# EAGLE schematic arduino-uno-shield (EAGLE 9.0.0)
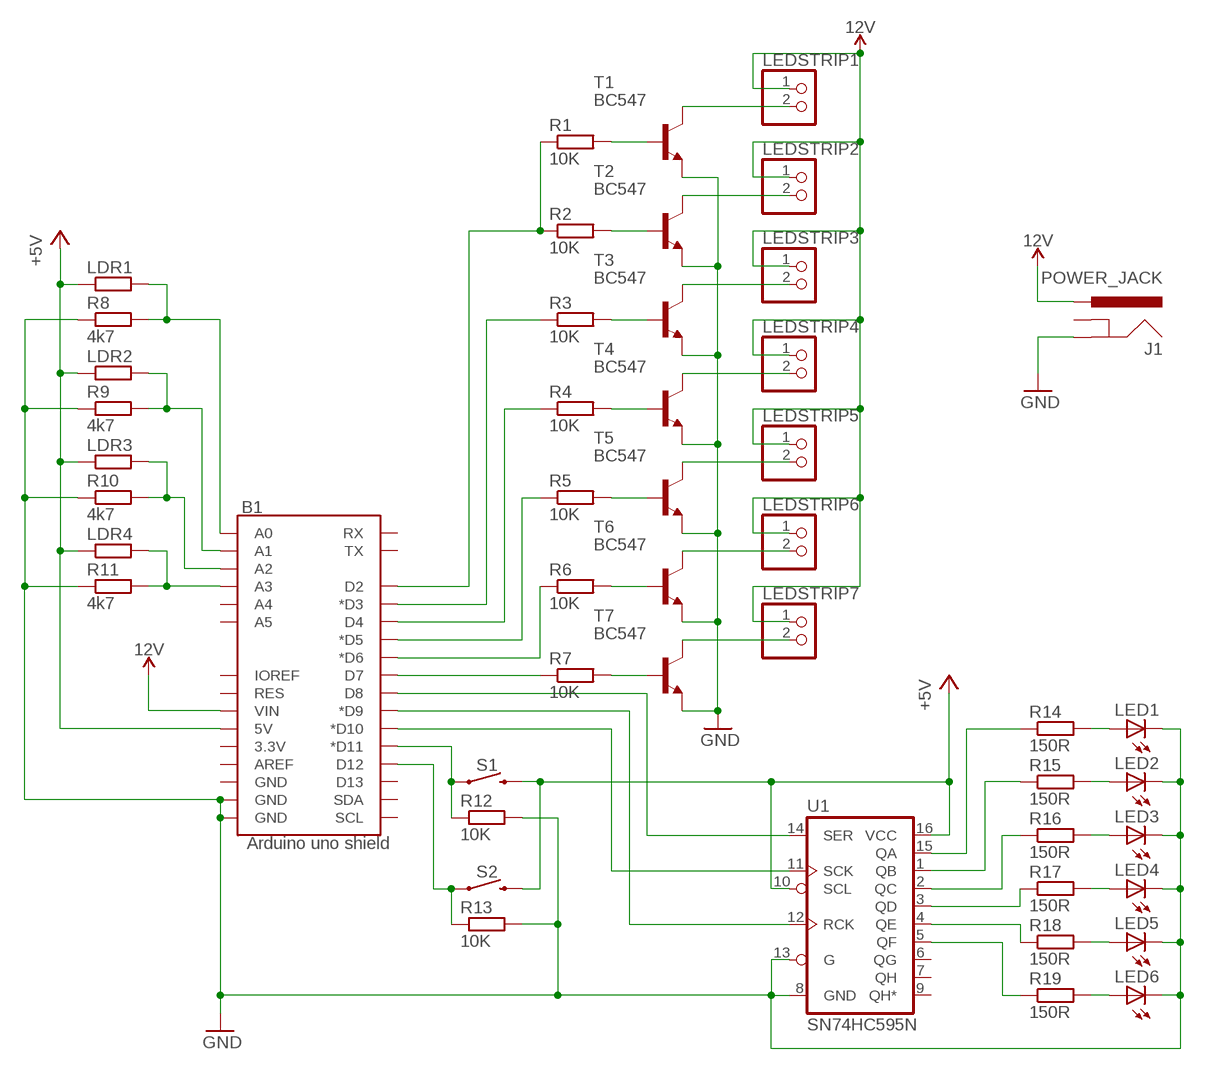
[diagram p0: schematic, sheet 1]

## Parts
B1  Arduino uno shield  ARDUINO_UNO_R3_SHIELDUNO_R3_SHIELD_NOLABELS_LOCK  [UNO_R3_SHIELD_NOLABELS_LOCK]
J1  POWER_JACK  [POWER_JACK_PTH]
LDR1  R-EU_0204/5  [0204/5]
LDR2  R-EU_0204/5  [0204/5]
LDR3  R-EU_0204/5  [0204/5]
LDR4  R-EU_0204/5  [0204/5]
LED1  LED5MM  [LED5MM]
LED2  LED5MM  [LED5MM]
LED3  LED5MM  [LED5MM]
LED4  LED5MM  [LED5MM]
LED5  LED5MM  [LED5MM]
LED6  LED5MM  [LED5MM]
LEDSTRIP1  PINHD-1X2  [1X02]
LEDSTRIP2  PINHD-1X2  [1X02]
LEDSTRIP3  PINHD-1X2  [1X02]
LEDSTRIP4  PINHD-1X2  [1X02]
LEDSTRIP5  PINHD-1X2  [1X02]
LEDSTRIP6  PINHD-1X2  [1X02]
LEDSTRIP7  PINHD-1X2  [1X02]
R1  10K  R-EU_0204/5  [0204/5]
R2  10K  R-EU_0204/5  [0204/5]
R3  10K  R-EU_0204/5  [0204/5]
R4  10K  R-EU_0204/5  [0204/5]
R5  10K  R-EU_0204/5  [0204/5]
R6  10K  R-EU_0204/5  [0204/5]
R7  10K  R-EU_0204/5  [0204/5]
R8  4k7  R-EU_0204/5  [0204/5]
R9  4k7  R-EU_0204/5  [0204/5]
R10  4k7  R-EU_0204/5  [0204/5]
R11  4k7  R-EU_0204/5  [0204/5]
R12  10K  R-EU_0204/5  [0204/5]
R13  10K  R-EU_0204/5  [0204/5]
R14  150R  R-EU_0204/5  [0204/5]
R15  150R  R-EU_0204/5  [0204/5]
R16  150R  R-EU_0204/5  [0204/5]
R17  150R  R-EU_0204/5  [0204/5]
R18  150R  R-EU_0204/5  [0204/5]
R19  150R  R-EU_0204/5  [0204/5]
S1  MOMENTARY-SWITCH-SPST-PTH-6.0MM  [TACTILE_SWITCH_PTH_6.0MM]
S2  MOMENTARY-SWITCH-SPST-PTH-6.0MM  [TACTILE_SWITCH_PTH_6.0MM]
T1  BC547  [TO92]
T2  BC547  [TO92]
T3  BC547  [TO92]
T4  BC547  [TO92]
T5  BC547  [TO92]
T6  BC547  [TO92]
T7  BC547  [TO92]
U1  SN74HC595N  74HC595N  [DIP16]

## Nets
12V: B1.VIN J1.PWR LEDSTRIP1.1 LEDSTRIP2.1 LEDSTRIP3.1 LEDSTRIP4.1 LEDSTRIP5.1 LEDSTRIP6.1 LEDSTRIP7.1
+5V: B1.5V LDR1.1 LDR2.1 LDR3.1 LDR4.1 S1.3 S2.3 U1.10(SCL) U1.16(VCC)
GND: B1.GND@0(GND) B1.GND@1(GND) J1.GND LED1.K(C) LED2.K(C) LED3.K(C) LED4.K(C) LED5.K(C) LED6.K(C) R8.1 R9.1 R10.1 R11.1 R12.2 R13.2 T1.1(E) T2.1(E) T3.1(E) T4.1(E) T5.1(E) T6.1(E) T7.1(E) U1.8(GND) U1.13(G)
N$1: R1.2 T1.2(B)
N$2: R2.2 T2.2(B)
N$3: LEDSTRIP1.2 T1.3(C)
N$4: R3.2 T3.2(B)
N$5: R4.2 T4.2(B)
N$6: R5.2 T5.2(B)
N$7: R6.2 T6.2(B)
N$8: R7.2 T7.2(B)
N$9: B1.D2 R1.1 R2.1
N$10: B1.D7 R7.1
N$11: B1.A0 LDR1.2 R8.2
N$12: B1.D3(*D3) R3.1
N$13: B1.D4 R4.1
N$14: B1.D5(*D5) R5.1
N$15: B1.D6(*D6) R6.1
N$16: B1.A1 LDR2.2 R9.2
N$17: B1.A2 LDR3.2 R10.2
N$18: B1.A3 LDR4.2 R11.2
N$19: B1.D11(*D11) R12.1 S1.1
N$20: B1.D12 R13.1 S2.1
N$21: R14.1 U1.15(QA)
N$22: B1.D8 U1.14(SER)
N$23: B1.D9(*D9) U1.12(RCK)
N$24: B1.D10(*D10) U1.11(SCK)
N$25: R15.1 U1.1(QB)
N$26: R16.1 U1.2(QC)
N$27: R17.1 U1.3(QD)
N$28: R18.1 U1.4(QE)
N$29: R19.1 U1.5(QF)
N$30: LED1.A R14.2
N$31: LED2.A R15.2
N$32: LED3.A R16.2
N$33: LED4.A R17.2
N$34: LED5.A R18.2
N$35: LED6.A R19.2
N$36: LEDSTRIP2.2 T2.3(C)
N$37: LEDSTRIP3.2 T3.3(C)
N$38: LEDSTRIP4.2 T4.3(C)
N$39: LEDSTRIP5.2 T5.3(C)
N$40: LEDSTRIP6.2 T6.3(C)
N$41: LEDSTRIP7.2 T7.3(C)
Unconnected: B1.3.3V B1.A4 B1.A5 B1.AREF B1.D13 B1.GND@2(GND) B1.IOREF B1.RES B1.RX B1.SCL B1.SDA B1.TX J1.GNDBREAK U1.6(QG) U1.7(QH) U1.9(QH*)

## Library data of the parts
B1 = SparkFun-Boards:ARDUINO_UNO_R3_SHIELD: Arduino R3 Shield Footprint Shield form compatible with the Arduino Uno R3. SparkFun Products: MG2639 Cellular Shield <https://www.sparkfun.com/products/13120> MIDI Shield <https://www.sparkfun.com/products/12898> R3 Stackable Headers Kit <https://www.sparkfun.com/products/11417>
J1 = SparkFun-Connectors:POWER_JACK: Power Jack Connector This is the standard 5.5mm barrel jack for power. The PTH is the most common, proven, reliable, footprint. The Slot footprint only works if the mill layer is transmitted to the PCB fab house so be warned. Here are the connectors we sell at SparkFun: DC Barrel Power Jack/Connector <https://www.sparkfun.com/products/119> (PRT-00119) DC Barrel Power Jack/Connector (SMD) <https://www.sparkfun.com/products/12748> (PRT-12748) DC Barrel Jack Adapter - Breadboard Compatible <https://www.sparkfun.com/products/10811> (PRT-10811) It is used on this SparkFun product (and many, many others): SparkFun RedBoard - Programmed with Arduino <https://www.sparkfun.com/products/12757> (DEV-12757) Also, if you need a mating power supply or connector, please check these out: Wall Adapter Power Supply - 9VDC 650mA <https://www.sparkfun.com/products/298> (TOL-00298) DC Barrel Jack Adapter - Male <https://www.sparkfun.com/products/10287> (PRT-10287); PROD_ID: CONN-08197
LDR1-LDR4 R1-R19 = rcl:R-EU_: RESISTOR, European symbol; SPICEPREFIX: R
LED1-LED6 = led:LED: LED OSRAM: - CHIPLED LG R971, LG N971, LY N971, LG Q971, LY Q971, LO R971, LY R971 LH N974, LH R974 LS Q976, LO Q976, LY Q976 LO Q996 - Hyper CHIPLED LW Q18S LB Q993, LB Q99A, LB R99A - SideLED LS A670, LO A670, LY A670, LG A670, LP A670 LB A673, LV A673, LT A673, LW A673 LH A674 LY A675 LS A676, LA A676, LO A676, LY A676, LW A676 LS A679, LY A679, LG A679 - Hyper Micro SIDELED® LS Y876, LA Y876, LO Y876, LY Y876 LT Y87S - SmartLED LW L88C, LW L88S LB L89C, LB L89S, LG L890 LS L89K, LO L89K, LY L89K LS L896, LA L896, LO L896, LY L896 - TOPLED LS T670, LO T670, LY T670, LG T670, LP T670 LSG T670, LSP T670, LSY T670, LOP T670, LYG T670 LG T671, LOG T671, LSG T671 LB T673, LV T673, LT T673, LW T673 LH T674 LS T676, LA T676, LO T676, LY T676, LB T676, LH T676, LSB T676, LW T676 LB T67C, LV T67C, LT T67C, LS T67K, LO T67K, LY T67K, LW E67C LS E67B, LA E67B, LO E67B, LY E67B, LB E67C, LV E67C, LT E67C LW T67C LS T679, LY T679, LG T679 LS T770, LO T770, LY T770, LG T770, LP T770 LB T773, LV T773, LT T773, LW T773 LH T774 LS E675, LA E675, LY E675, LS T675 LS T776, LA T776, LO T776, LY T776, LB T776 LHGB T686 LT T68C, LB T68C - Hyper Mini TOPLED® LB M676 - Mini TOPLED Santana® LG M470 LS M47K, LO M47K, LY M47K Source: http://www.osram.convergy.de LUXEON: - LUMILED® LXK2-PW12-R00, LXK2-PW12-S00, LXK2-PW14-U00, LXK2-PW14-V00 LXK2-PM12-R00, LXK2-PM12-S00, LXK2-PM14-U00 LXK2-PE12-Q00, LXK2-PE12-R00, LXK2-PE12-S00, LXK2-PE14-T00, LXK2-PE14-U00 LXK2-PB12-K00, LXK2-PB12-L00, LXK2-PB12-M00, LXK2-PB14-N00, LXK2-PB14-P00, LXK2-PB14-Q00 LXK2-PR12-L00, LXK2-PR12-M00, LXK2-PR14-Q00, LXK2-PR14-R00 LXK2-PD12-Q00, LXK2-PD12-R00, LXK2-PD12-S00 LXK2-PH12-R00, LXK2-PH12-S00 LXK2-PL12-P00, LXK2-PL12-Q00, LXK2-PL12-R00 Source: www.luxeon.com KINGBRIGHT: KA-3528ASYC Source: www.kingbright.com
LEDSTRIP1-LEDSTRIP7 = pinhead:PINHD-1X2: PIN HEADER
S1 S2 = SparkFun-Switches:MOMENTARY-SWITCH-SPST: Momentary Switch (Pushbutton) - SPST Normally-open (NO) SPST momentary switches (buttons, pushbuttons). Variants PTH-12MM - 12mm square, through-hole Momentary Pushbutton Switch - 12mm Square <https://www.sparkfun.com/products/9190> (COM-09190) PTH-6.0MM, PTH-6.0MM-KIT - 6.0mm square, through-hole Mini Pushbutton Switch <https://www.sparkfun.com/products/97> (COM-00097) KIT package intended for soldering kit's - only one side of pads' copper is exposed. PTH-RIGHT-ANGLE-KIT - Right-angle, through-hole Right Angle Tactile Button <https://www.sparkfun.com/products/10791> - Used on SparkFun BigTime Watch Kit <https://www.sparkfun.com/products/11734> SMD-12MM - 12mm square, surface-mount Tactile Button - SMD (12mm) <https://www.sparkfun.com/products/12993> (COM-12993) Used on SparkFun PicoBoard <https://www.sparkfun.com/products/11888> SMD-4.5MM - 4.5mm Square Trackball Switch Used on SparkFun Blackberry Trackballer Breakout <https://www.sparkfun.com/products/13169> SMD-4.6MMX2.8MM - 4.60mm x 2.80mm, surface mount Used on SparkFun SAMD21 Mini Breakout <https://www.sparkfun.com/products/13664> SMD-5.2MM, SMD-5.2-REDUNDANT - 5.2mm square, surface-mount Mini Pushbutton Switch - SMD <https://www.sparkfun.com/products/8720> (COM-08720) Used on Arduino Pro Mini <https://www.sparkfun.com/products/11114> REDUNDANT package connects both switch circuits together SMD-6.0X3.5MM - 6.0 x 3.5mm, surface mount Momentary Reset Switch SMD <https://www.sparkfun.com/products/8229> (COM-08229) SMD-6.2MM-TALL - 6.2mm square, surface mount Tactile Button - SMD (6mm) <https://www.sparkfun.com/products/12992> Used on SparkFun Digital Sandbox <https://www.sparkfun.com/products/12651> SMD-RIGHT-ANGLE - Right-angle, surface mount Used on SparkFun Block for Intel® Edison - Arduino <https://www.sparkfun.com/products/13036>; PROD_ID: SWCH-08441; SF_SKU: COM-00097
T1-T7 = transistor-neu-to92:BC547: NPN TRANSISTOR
U1 = SparkFun-IC-Logic:74*595: 8-Bit Shift Register (Serial to Parallel) Datasheet <http://cdn.sparkfun.com/datasheets/BreakoutBoards/MM74HC595.pdf> SparkFun Products SparkFun Shift Register Breakout - 74HC595 <https://www.sparkfun.com/products/10680> (BOB-10680); PROD_ID: IC-13123